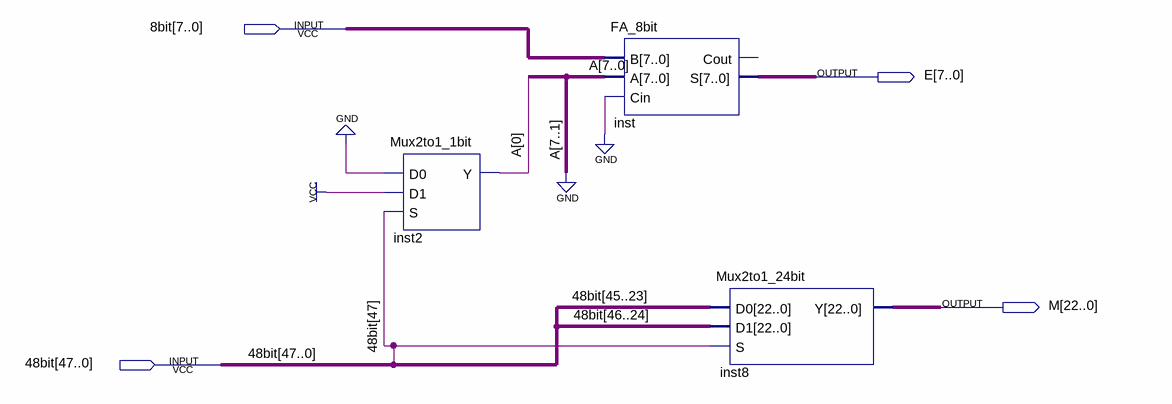
[diagram p0: schematic sheet]
// Quartus schematic Normalizer.bdf as structural Verilog: 3 symbols, 4 pins
module Normalizer (
  input  [7:0] \8bit ,
  input  [47:0] \48bit ,
  output [7:0] E,
  output [22:0] M
);

  wire [0:0] A;

  Mux2to1_1bit inst2 (.D0(1'b0), .D1(1'b1), .S(\48bit [47]), .Y(A[0]));
  FA_8bit inst (.B(\8bit ), .A({{7{1'b0}}, A[0]}), .Cin(1'b0), .S(E));  // open: Cout
  Mux2to1_24bit inst8 (.D0(\48bit [45:23]), .D1(\48bit [46:24]), .S(\48bit [47]), .Y(M));
endmodule
